# EAGLE design Turing_mini_expander (EAGLE 7.4.0)

## Sheet 1 of 2
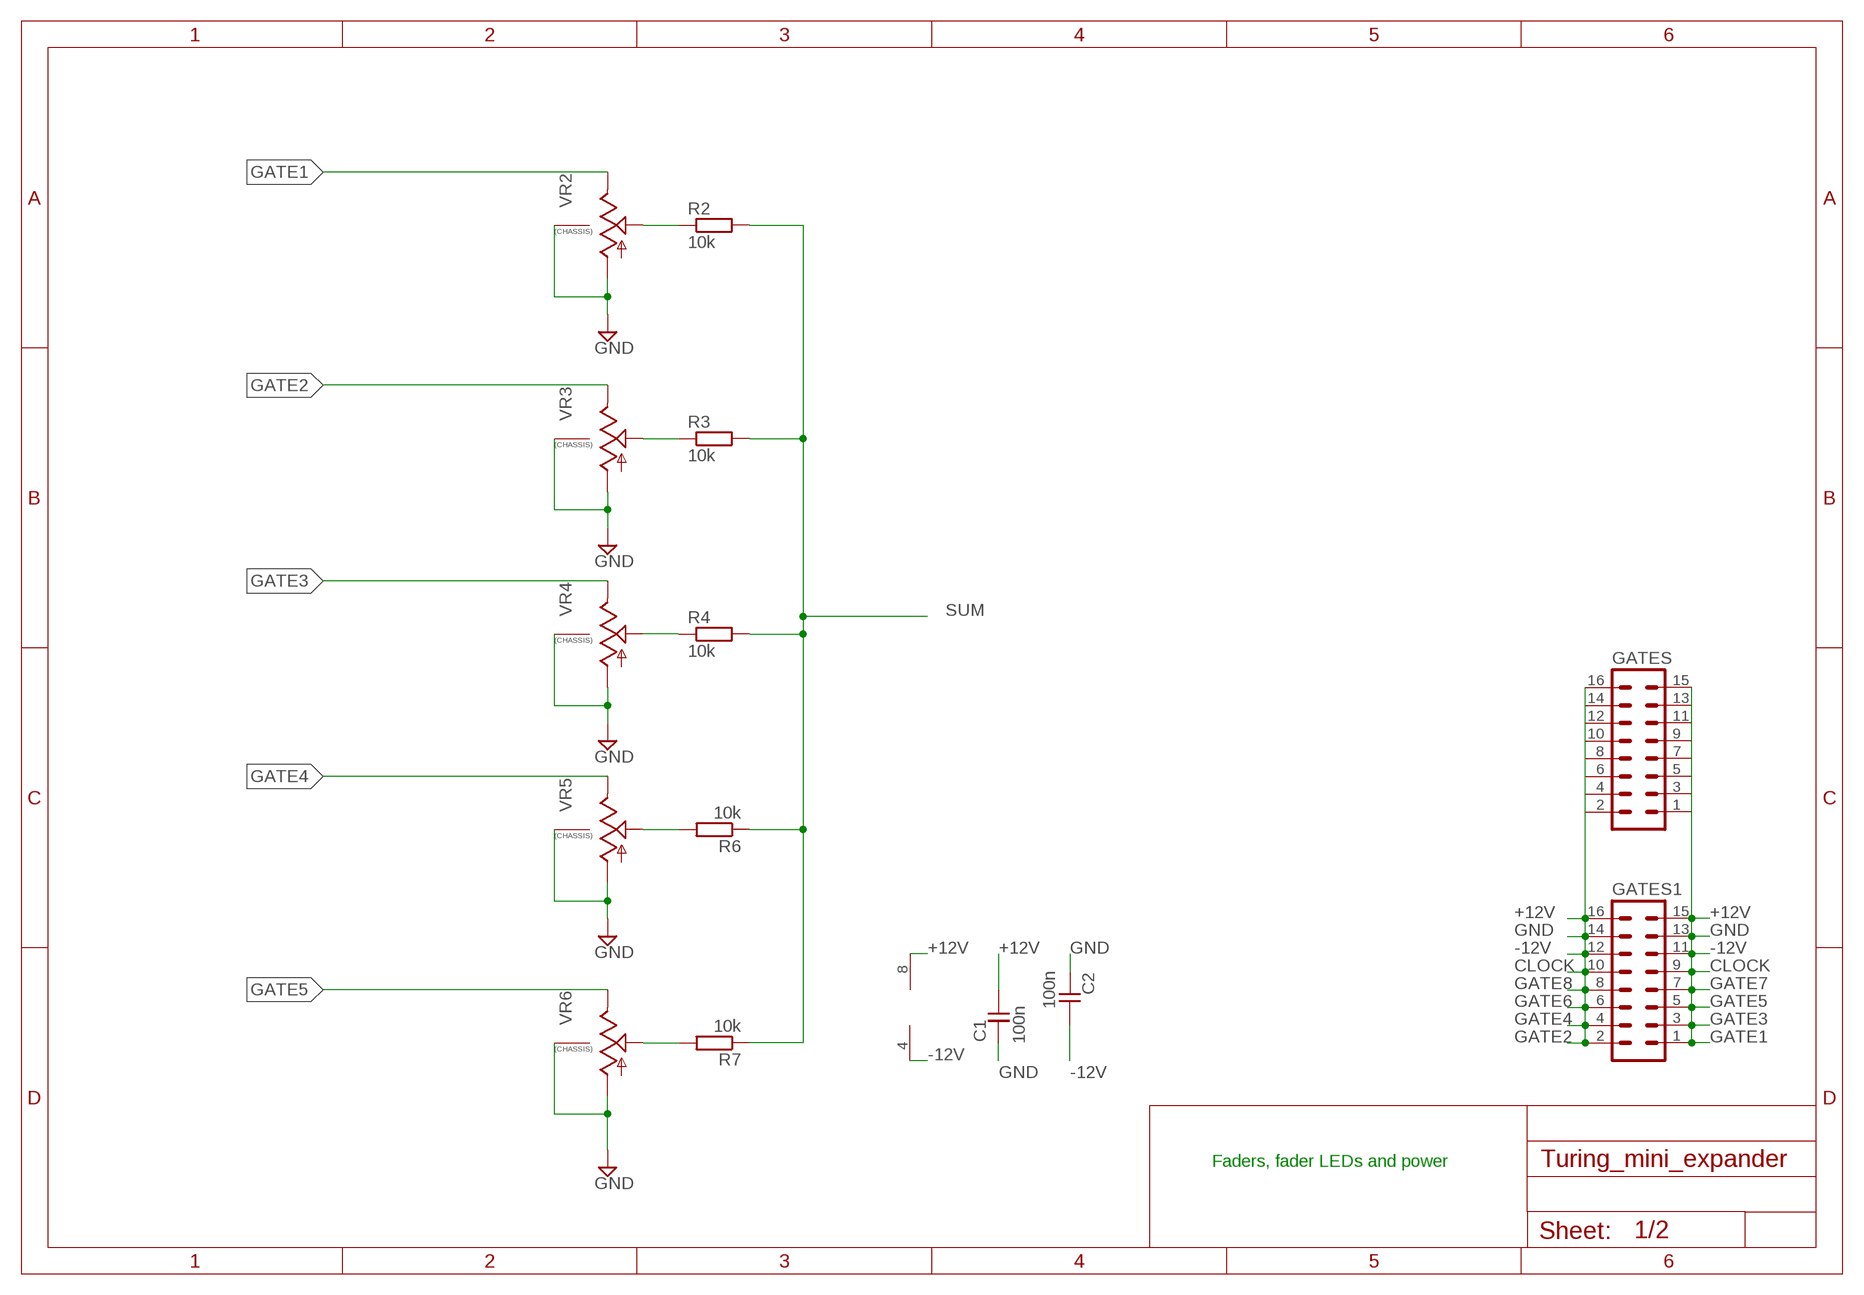
[diagram p0: schematic, sheet 1]

### Parts
C1  100n  C-EU050-024X044  [C050-024X044]
C2  100n  C-EU050-024X044  [C050-024X044]
GATES  MA08-2  [MA08-2]
GATES1  MA08-2  [MA08-2]
R2  10k  RESISTOR7MM  [7MM_RESISTOR]
R3  10k  RESISTOR7MM  [7MM_RESISTOR]
R4  10k  RESISTOR7MM  [7MM_RESISTOR]
R6  10k  RESISTOR7MM  [7MM_RESISTOR]
R7  10k  RESISTOR7MM  [7MM_RESISTOR]
U1  TL072_  [DIL08]
VR2  9MM_SNAP-IN_POT_CHASSIS  [9MM_SNAP-IN_POT]
VR3  9MM_SNAP-IN_POT_CHASSIS  [9MM_SNAP-IN_POT]
VR4  9MM_SNAP-IN_POT_CHASSIS  [9MM_SNAP-IN_POT]
VR5  9MM_SNAP-IN_POT_CHASSIS  [9MM_SNAP-IN_POT]
VR6  9MM_SNAP-IN_POT_CHASSIS  [9MM_SNAP-IN_POT]

### Nets
+12V [power]: C1.1 GATES1.15 GATES1.16 GATES.15 GATES.16 U1.8(P:V+)
-12V [power]: C2.1 GATES1.11 GATES1.12 GATES.11 GATES.12 U1.4(P:V-)
CLOCK: GATES1.9 GATES1.10 GATES.9 GATES.10
GATE1: GATES1.1 GATES.1 VR2.3(E)
GATE2: GATES1.2 GATES.2 VR3.3(E)
GATE3: GATES1.3 GATES.3 VR4.3(E)
GATE4: GATES1.4 GATES.4 VR5.3(E)
GATE5: GATES1.5 GATES.5 VR6.3(E)
GATE6: GATES1.6 GATES.6
GATE7: GATES1.7 GATES.7
GATE8: GATES1.8 GATES.8
GND [ground]: C1.2 C2.2 GATES1.13 GATES1.14 GATES.13 GATES.14 VR2.1(A) VR2.CHASSIS2 VR3.1(A) VR3.CHASSIS2 VR4.1(A) VR4.CHASSIS2 VR5.1(A) VR5.CHASSIS2 VR6.1(A) VR6.CHASSIS2 ; also sheet 2
N$2: R2.1 VR2.2(S)
N$16: R3.1 VR3.2(S)
N$19: R4.1 VR4.2(S)
N$20: R6.2 VR5.2(S)
N$21: R7.2 VR6.2(S)
SUM: R2.2 R3.2 R4.2 R6.1 R7.1 ; also sheet 2

### Notes on the sheet
- Faders, fader LEDs and power

## Sheet 2 of 2
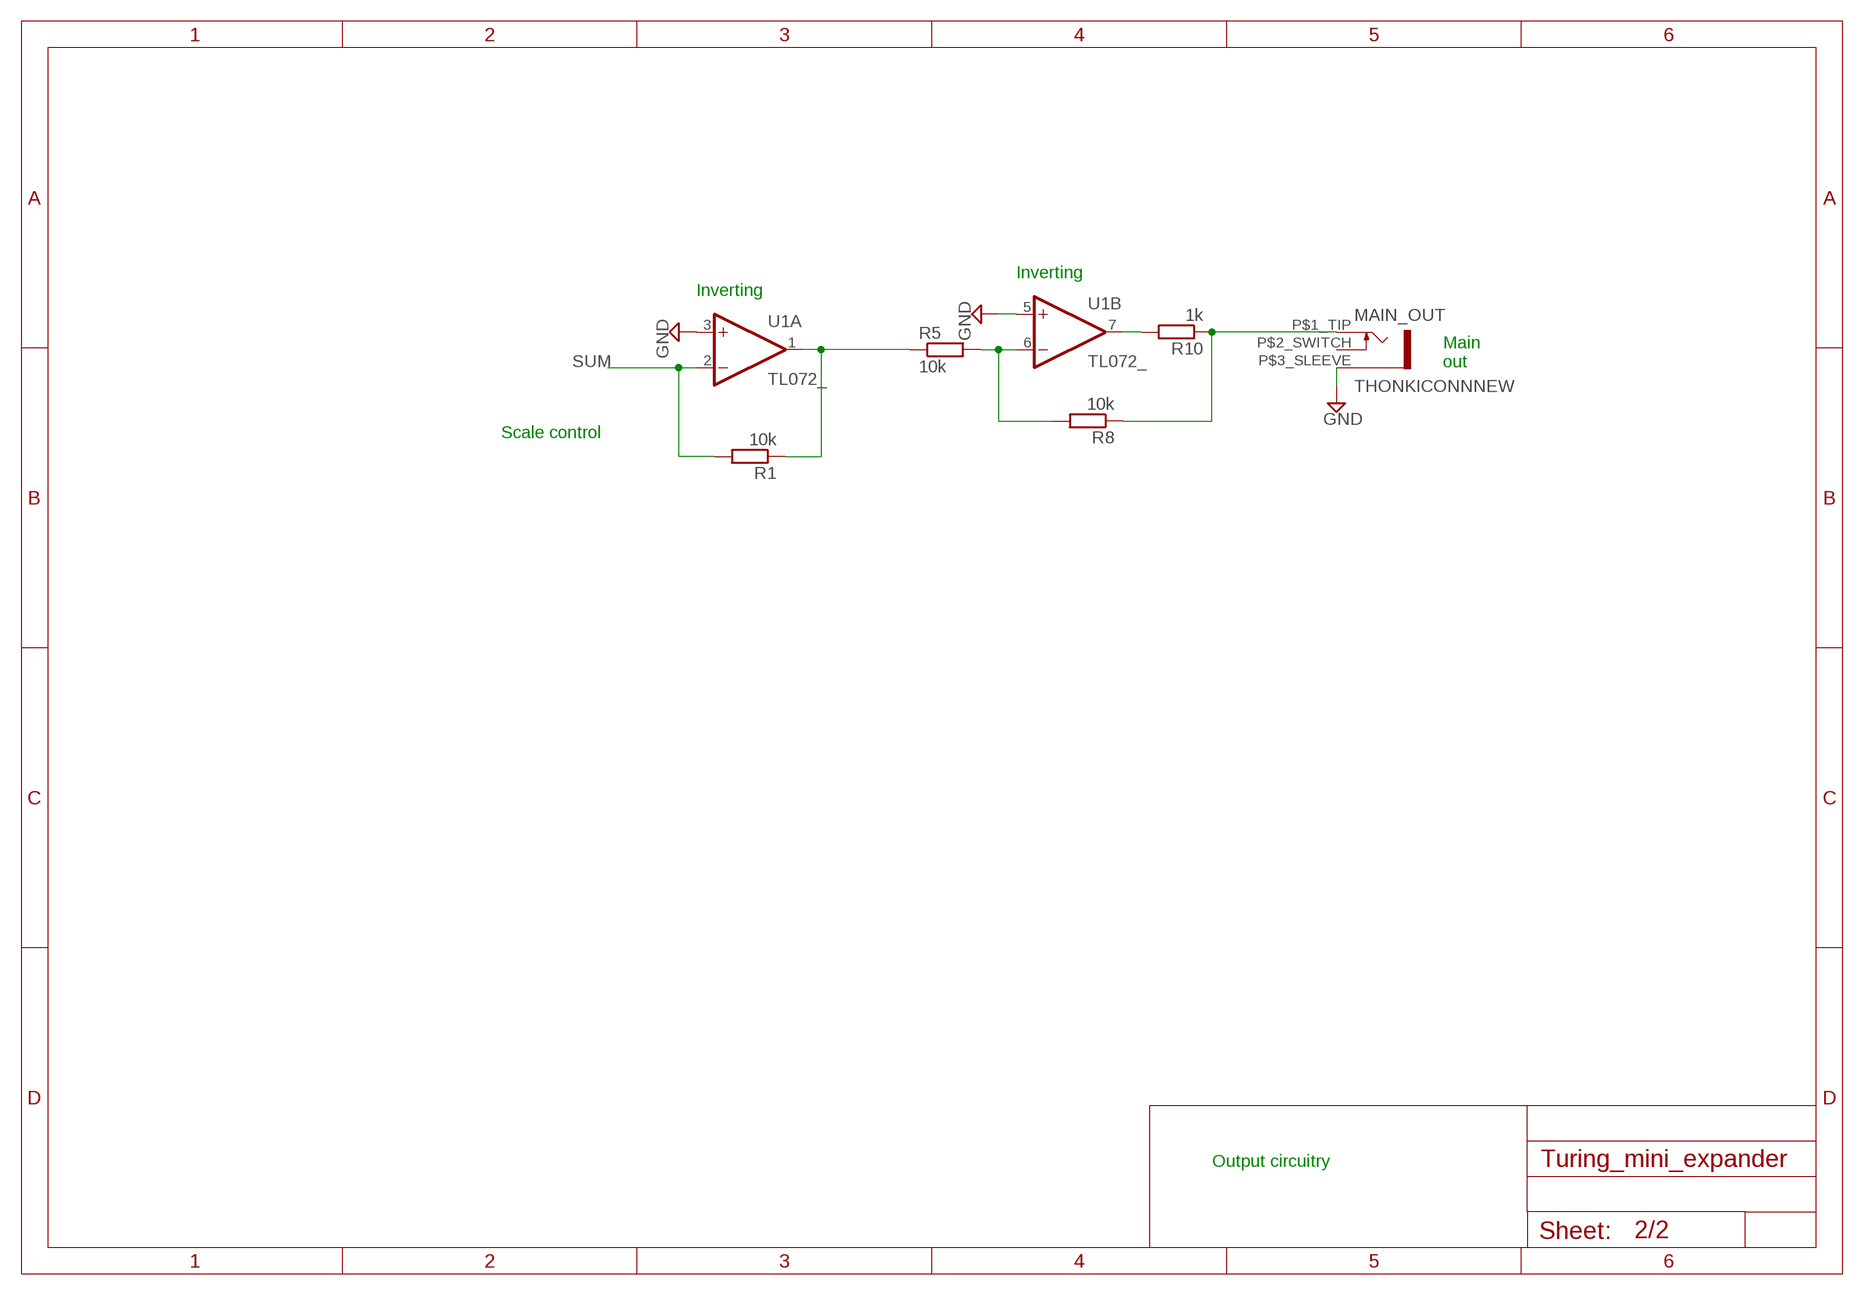
[diagram p1: schematic, sheet 2]

### Parts
MAIN_OUT  THONKICONNNEW  [WQP-PJ301M-12_JACK]
R1  10k  RESISTOR7MM  [7MM_RESISTOR]
R5  10k  RESISTOR7MM  [7MM_RESISTOR]
R8  10k  RESISTOR7MM  [7MM_RESISTOR]
R10  1k  RESISTOR7MM  [7MM_RESISTOR]

### Nets
GND [ground]: MAIN_OUT.P$3_SLEEVE(SLEEVE) U1.3(A:+IN) U1.5(B:+IN) ; also sheet 1
N$4: R5.2 R8.2 U1.6(B:-IN)
N$5: MAIN_OUT.P$1_TIP(TIP) R8.1 R10.1
N$6: R10.2 U1.7(B:OUT)
N$15: R1.1 R5.1 U1.1(A:OUT)
SUM: R1.2 U1.2(A:-IN) ; also sheet 1
Unconnected: MAIN_OUT.P$2_SWITCH(SWITCH)

### Notes on the sheet
- Inverting
- Inverting
- Main
  out
- Scale control
- Output circuitry

## Library data of the parts
C1 C2 = TomW:C-EU: CAPACITOR, European symbol
GATES GATES1 = con-lstb:MA08-2: PIN HEADER; OC_FARNELL: unknown; OC_NEWARK: unknown
MAIN_OUT = MusicThingModular:THONKICONN: 3.5mm socket for Eurorack modular synths
R1-R8 R10 = MusicThingModular:RESISTOR: Standard resistor, various versions
U1 = MusicThingModular:TL072: Generic Dual Op Amp
VR2-VR6 = MusicThingModular:9MM_SNAP-IN_POT_CHASSIS: 9mm vertical snap-in pot, Alpha / Panasonic style, with a connection to the metal chassis for grounding

## Net classes
0 default: width 0.254 mm
1 power: width 0.406 mm
2 ground: width 0.406 mm

## Board
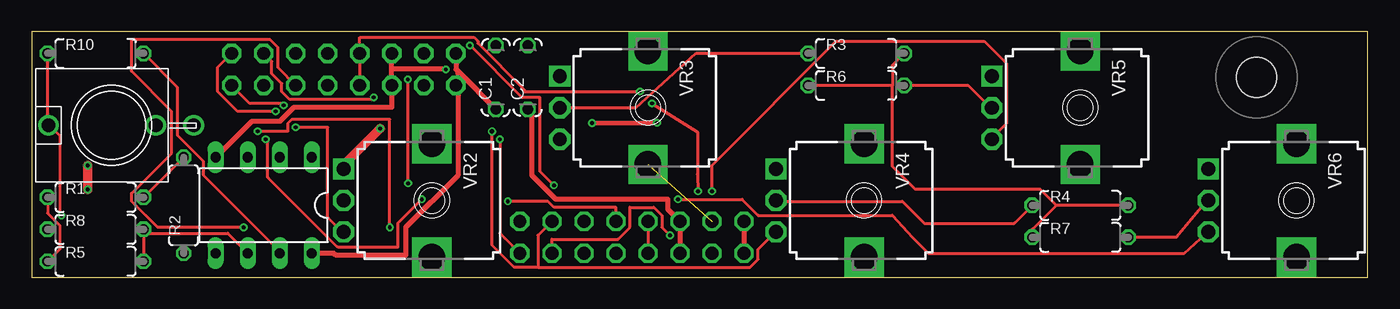
[diagram p2: board, top side]
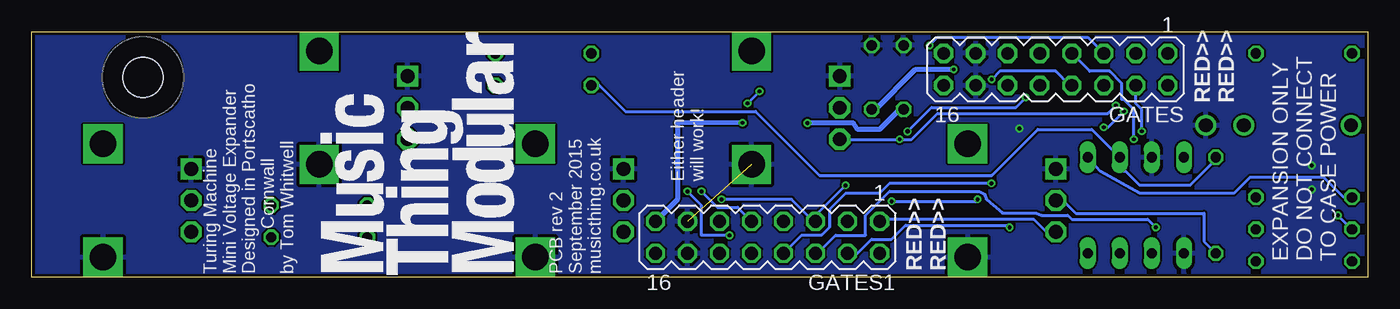
[diagram p3: board, bottom side, seen from below]

Size 106 x 19.5 mm. Coordinates in mm from the lower left corner, seen from the top.
Outline: 0,0 106,0 106,19.5 0,19.5 0,0
Copper layers (1*2*15*16): Top 0.035mm / dielectric 0.2mm / Route2 0.0175mm / dielectric 1.1mm / Route15 0.0175mm / dielectric 0.2mm / Bottom 0.035mm
Design rules "SeeedStudio_DRU_no_angle_20130527": minimum track width 6mil, minimum drill 12mil, track to track 6mil, track to pad 6mil, pad to pad 6mil, via to via 6mil, smd to smd 0mil, copper to edge 10mil, drill to drill 10mil, minimum pad ring 6mil, minimum via ring 6mil, stop-mask expansion 2mil, vias tented up to drill 25mil, thermal gap 10mil

### Footprints (pad centres in the part's own frame; a part is rotated, then mirrored left to right if it is on the bottom)
C050-024X044 = drill 0.813 octagon: 1 -2.54,0; 2 2.54,0
MA08-2 = drill 1.016 octagon: 1 -8.89,-1.27; 2 -8.89,1.27; 3 -6.35,-1.27; 4 -6.35,1.27; 5 -3.81,-1.27; 6 -3.81,1.27; 7 -1.27,-1.27; 8 -1.27,1.27; 9 1.27,-1.27; 10 1.27,1.27; 11 3.81,-1.27; 12 3.81,1.27; 13 6.35,-1.27; 14 6.35,1.27; 15 8.89,-1.27; 16 8.89,1.27
WQP-PJ301M-12_JACK = drill 1.1: P$1_TIP 0,5; P$2_SWITCH 0,-3.5; P$3_SLEEVE 0,-6.5
7MM_RESISTOR = drill 0.813 octagon: 1 -3.81,0; 2 3.81,0
DIL08 = drill 0.813 pad 1.27 long: 1 -3.81,-3.81; 2 -1.27,-3.81; 3 1.27,-3.81; 4 3.81,-3.81; 5 3.81,3.81; 6 1.27,3.81; 7 -1.27,3.81; 8 -3.81,3.81
MOUNTING_HOLE = hole 3.2: 0,0
9MM_SNAP-IN_POT = drill 1.1 pad 1.676 square: 1 -2.5,-7 | drill 1.1 pad 1.676 octagon: 2 0,-7; 3 2.5,-7 | drill 2.1 pad 2.8 square: CHASSIS1 -4.5,0; CHASSIS2 4.5,0

### Placement (x,y rotation side)
C1  36.83,15.88 90 top
C2  39.37,15.88 90 top
GATES  24.77,16.51 180 bottom
GATES1  47.62,3.17 180 bottom
MAIN_OUT  6.35,12.06 90 top
R1  5.08,6.35 0 top
R2  12.06,5.71 90 top
R3  65.41,17.78 0 top
R4  83.19,5.71 0 top
R5  5.08,1.27 0 top
R6  65.41,15.24 0 top
R7  83.19,3.17 0 top
R8  5.08,3.81 0 top
R10  5.08,17.78 0 top
U1  18.41,5.71 180 top
U$1  [MOUNTING_HOLE]  97.16,15.88 0 top
VR2  31.75,6.1 270 top
VR3  48.9,13.46 270 top
VR4  66.04,6.1 270 top
VR5  83.19,13.46 270 top
VR6  100.33,6.1 270 top

### Tracks (layer width: path | path; a pad name or v marks a point on that pad's centre or on a via)
+12V  (via drill 0.3, 0.33)
  Top 0.406: GATES1.15 GATES1.16 | 33.89,16.27 33.66,16.51 GATES.15 | 33.89,16.27 C1.1 | U1.8 23.97,1.91 24.13,1.75 29.69,1.75 29.69,3.97 33.81,8.1 33.81,15.24 | 33.81,15.24 33.81,16.19 33.89,16.27 | GATES.16 33.81,15.24 | v44.45,12.24 v49.61,12.27
  Bottom 0.406: GATES1.15 54.77,6.19 54.77,12.24 v49.61,12.27 | v44.45,12.24 40.82,12.24 40.48,11.75 38.73,11.75 37.15,13.34 C1.1
-12V  (via drill 0.3)
  Top 0.406: U1.4 17.46,12.38 19.68,12.38 20.8,13.49 28.57,13.49 GATES.12 28.57,16.51 | 28.57,16.51 GATES.11 | C2.1 39.69,13.02 39.69,8.1 41.59,6.19 50.48,6.19 50.48,5.4 GATES1.11 GATES1.12 | v32.86,16.51 28.57,16.51
  Bottom 0.406: v32.86,16.51 35.88,16.51 39.05,13.34 C2.1
CLOCK  (via drill 0.3)
  Top 0.254: GATES1.9 GATES1.10 | GATES.10 GATES.9 26.04,19.05 35.08,19.05 35.4,18.73 35.4,18.57 39.05,14.92 39.05,14.76 v48.26,14.76 | v52.86,6.83 52.82,8.2 52.82,11.54 v49.21,13.81
  Bottom 0.254: GATES1.9 50.01,5.56 51.59,5.56 v52.86,6.83 | v48.26,14.76 v49.21,13.81
GATE1  (via drill 0.3)
  Top 0.254: GATES.1 14.76,16.67 14.76,14.76 16.35,13.18 v19.37,13.18 | v20.95,11.91 23.5,11.91 23.5,4.76 24.61,3.65 VR2.3
  Bottom 0.254: v19.37,13.18 20.64,11.91 v20.95,11.91 | GATES1.1 38.58,4.6 26.51,4.6 25.56,3.65 24.77,3.65 VR2.3
GATE2  (via drill 0.3)
  Top 0.254: GATES.2 17.3,13.81 20,13.81 v20,13.65 | GATES1.2 37.15,3.49 v37.15,10.95
  Bottom 0.254: v20,13.65 20.64,13.02 34.13,13.02 36.2,10.95 v37.15,10.95 41.75,10.95 VR3.3
GATE3  (via drill 0.3, 0.33)
  Top 0.254: GATES.3 19.05,17.14 19.05,16.19 19.84,15.4 19.84,14.76 20.48,14.13 27.15,14.13 v27.15,14.29 | v36.51,11.59 36.51,2.54 38.26,0.79 40.16,0.79 | 40.16,0.79 40.16,3.33 GATES1.3 | 40.16,0.79 56.99,0.79 57.63,1.43 57.63,2.22 58.9,3.49 VR4.3
  Bottom 0.254: v27.15,14.29 27.94,13.49 34.61,13.49 v36.51,11.59
GATE4  (via drill 0.3)
  Top 0.254: v17.94,11.59 20.32,11.59 20.32,12.22 20.64,12.54 28.42,12.54 v28.42,3.97 | v53.98,6.83 53.98,8.89 63.82,18.73 75.56,18.73 77.31,16.99 77.31,12.22 76.2,11.11 VR5.3 | v50.64,3.33 50.01,3.97 50.01,4.92 49.37,5.56 47.47,5.56 47.47,3.97 46.51,3.02 41.27,3.02 GATES1.4
  Bottom 0.254: GATES.4 18.41,13.81 17.94,13.34 v17.94,11.59 | v28.42,3.97 28.57,4.13 36.67,4.13 37.78,3.02 39.37,3.02 40.48,1.91 GATES1.4 | v53.98,6.83 52.86,5.71 52.86,3.33 v50.64,3.33
GATE5  (via drill 0.3)
  Top 0.254: v34.77,18.41 38.89,14.29 40.32,14.29 40.32,8.41 v41.43,7.3 | v51.28,6.19 56.36,6.19 57.63,4.92 68.26,4.92 69.85,3.17 71.12,1.91 91.44,1.91 93.19,3.49 VR6.3
  Bottom 0.254: GATES.5 22.23,19.05 34.13,19.05 v34.77,18.41 | v41.43,7.3 43.81,4.92 43.81,4.76 | v51.28,6.19 45.72,6.19 44.29,4.76 43.81,4.76 | 43.81,4.76 GATES1.5
GATE6  (via drill 0.3)
  Top 0.254: GATES.6 19.53,16.67 19.53,18.26 18.89,18.89 7.94,18.89 7.94,16.35 11.11,13.18 11.11,9.84 7.94,6.67 7.94,6.03 10,3.97 v16.83,3.97
  Bottom 0.254: v16.83,3.97 17.46,4.6 23.5,4.6 23.81,4.92 25.88,4.92 26.36,5.1 29.01,5.1 30.28,6.2 30.4,6.6 30.81,6.81 37.94,6.83 39.85,4.92 39.85,3.33 42.23,3.33 43.66,1.91 GATES1.6
GATE7  (via drill 0.3)
  Top 0.254: v18.57,10.95 18.73,10.79 18.73,7.94 24.29,2.38 29.05,2.38 29.05,4.29 v30.96,6.19 | v37.78,6.03 40.96,6.03 41.43,5.56 46.35,5.56 GATES1.7
  Bottom 0.254: GATES.7 22.07,16.35 20.48,16.35 19.53,15.4 19.53,14.13 19.37,14.13 18.57,13.34 v18.57,10.95 | v30.96,6.19 31.11,6.03 v37.78,6.03
GATE8  (via drill 0.3)
  Top 0.254: v29.86,7.46 29.84,7.46 v29.84,15.72
  Bottom 0.254: GATES1.8 44.93,3.33 43.34,3.33 42.7,3.97 42.7,5.4 41.43,6.67 38.73,6.67 37.94,7.46 v29.86,7.46 | v29.84,15.72 29.21,16.35 24.77,16.35 23.65,15.24 GATES.8
GND  (via drill 0.33)  (1 unrouted)
  Top 0.762: v4.45,8.89 v4.45,6.99 | VR2.1 24.75,8.93 v27.65,11.82
  pour Bottom: -1.27,-2.54 106.05,-2.54 106.05,21.59 -1.27,21.59
N$2
  Bottom 0.254: R2.1 13.02,2.86 13.02,5.08 23.18,5.08 24.13,6.03 24.61,6.03 VR2.2
N$4
  Top 0.254: 8.89,3.49 R5.2 | U1.6 15.56,3.49 8.89,3.49 | 8.89,3.49 R8.2
N$5  (via drill 0.3)
  Top 0.254: v2.38,4.92 2.22,5.08 2.22,11.27 1.43,12.06 MAIN_OUT.P$1_TIP 1.27,12.06 R10.1
  Bottom 0.254: v2.38,4.92 R8.1
N$6
  Top 0.254: R10.2 11.59,15.08 11.59,11.27 13.65,9.21 13.65,8.1 19.68,2.06 U1.7
N$15
  Top 0.254: R5.1 2.22,2.22 2.22,4.13 1.27,5.08 R1.1
  Bottom 0.254: U1.1 21.24,8.41 18.1,6.67 10.64,6.67 9.37,7.94 3.49,7.94 1.91,6.35 R1.1
N$16
  Top 0.254: R3.1 52.7,17.78 47.94,13.49 41.91,13.49 VR3.2
N$19
  Top 0.254: R4.1 77.95,4.29 70.8,4.29 69.06,6.03 59.05,6.03 VR4.2
N$20
  Top 0.254: R6.2 74.3,15.24 76.04,13.49 VR5.2
N$21
  Top 0.254: R7.2 90.81,3.17 93.19,6.03 VR6.2
SUM
  Top 0.254: R2.2 R1.2 | 68.26,15.24 R6.1 | 68.26,15.24 68.26,16.83 R3.2 | 68.26,15.24 68.26,14.76 68.28,14.75 68.28,8.8 70.09,6.99 80.01,6.99 81.28,5.71 | R4.2 81.28,5.71 | R7.1 79.38,3.81 81.28,5.71
  Bottom 0.254: R2.2 12.06,9.37 14.13,7.3 18.1,7.3 19.21,8.41 19.68,8.41 U1.2 21.91,11.75 26.19,11.75 29.84,8.1 43.5,8.1 48.58,13.18 58.9,13.18 60.96,15.24 R6.1

### Text on the board
bPlace: RED>> / RED>> | Either header / will work! | EXPANSION ONLY / DO NOT CONNECT / TO CASE POWER | RED>> / RED>> | Turing Machine / Mini Voltage Expander / Designed in Portscatho / Cornwall / by Tom Whitwell / / / / / / / / / / / / / / PCB rev 2 / September 2015 / musicthing.co.uk